# Altium schematic sheet ESC.SchDoc: Top Level
size A3; CompanyName: NOT USED; DocumentNumber: 2; SheetNumber: 2; SheetTotal: 2; PageSetup: Record=PageOptions|CenterHorizontal=True|CenterVertical=True|PrintScale=1.00|XCorrection=1.00|YCorrection=1.00|PrintKind=0|BorderSize=5000000|LeftOffset=0|BottomOffset=0|Orientation=2|PaperLength=1000|PaperWidth=1000|Scale=100|PaperSource=7|PrintQuality=-4|MediaType=1|DitherType=10|PaperKind=A3|PrintScaleMode=0
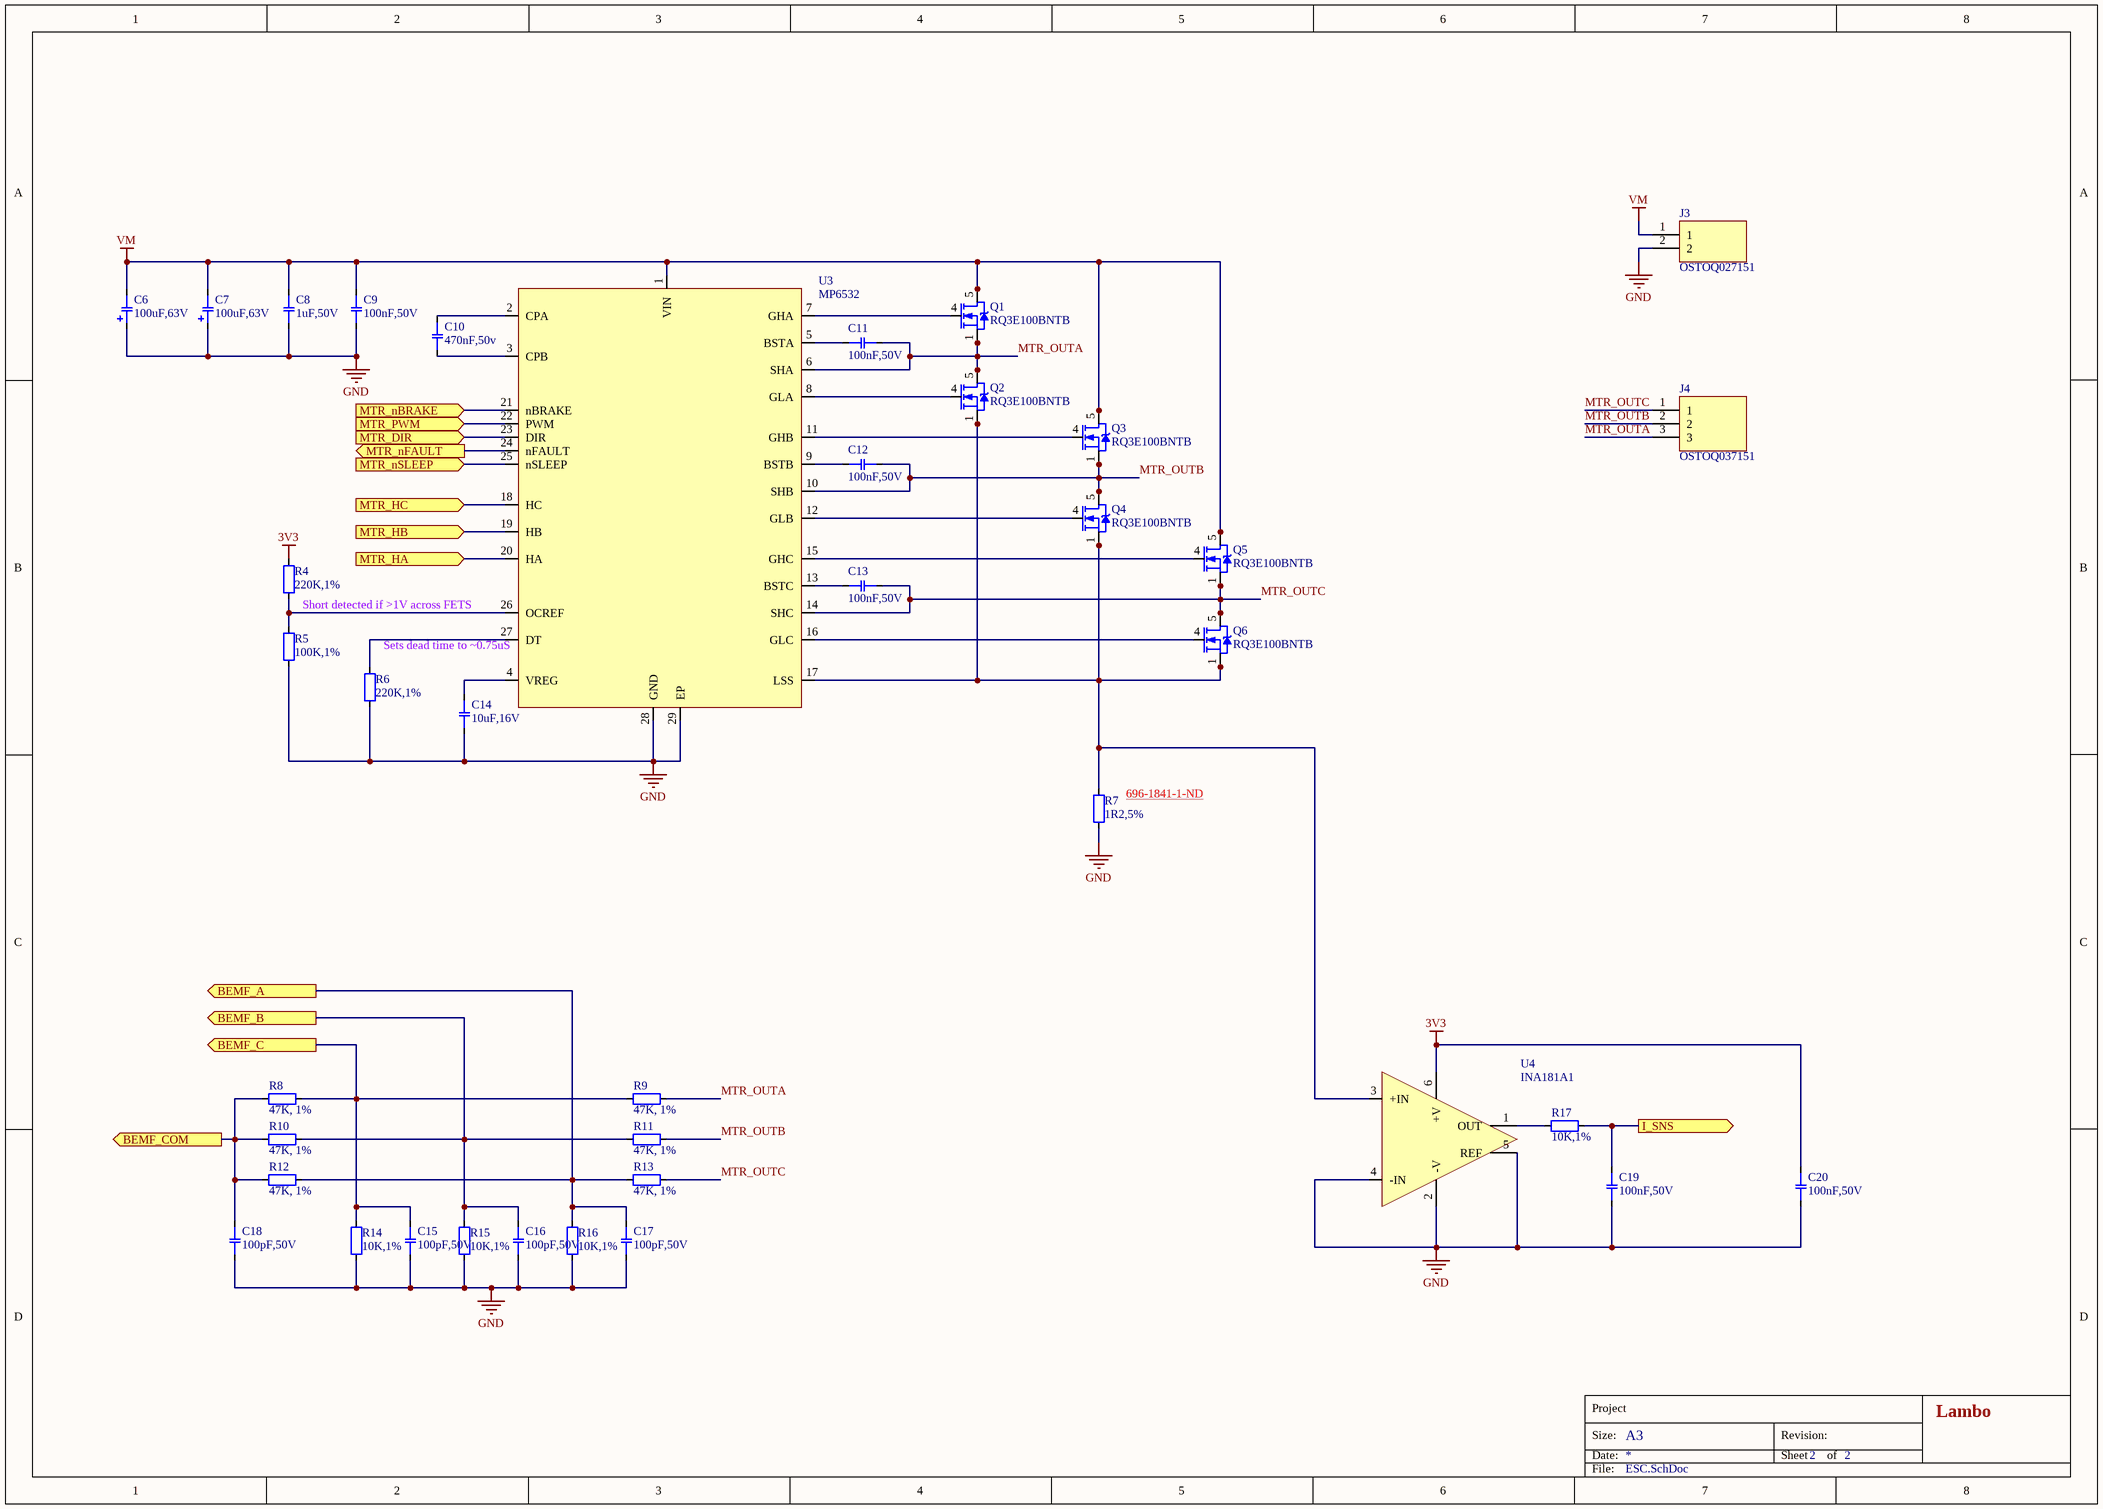
[diagram p0: ESC.SchDoc]

## Parts
C6  100uF,63V  [CAPAE1030X1020N]
C7  100uF,63V  [CAPAE1030X1020N]
C8  1uF,50V  [CAPC1608X09N_0603]
C9  100nF,50V  [CAPC1608X09N_0603]
C10  470nF,50v  [CAPC1608X09N_0603]
C11  100nF,50V  [CAPC1608X09N_0603]
C12  100nF,50V  [CAPC1608X09N_0603]
C13  100nF,50V  [CAPC1608X09N_0603]
C14  10uF,16V  [CAPC2012X12N_0805]
C15  100pF,50V  [CAPC1608X09N_0603]
C16  100pF,50V  [CAPC1608X09N_0603]
C17  100pF,50V  [CAPC1608X09N_0603]
C18  100pF,50V  [CAPC1608X09N_0603]
C19  100nF,50V  [CAPC1608X09N_0603]
C20  100nF,50V  [CAPC1608X09N_0603]
J3  OSTOQ027151  [ONSHORE_OSTOQ027151]
J4  OSTOQ037151  [ONSHORE_OSTOQ037151]
Q1  RQ3E100BNTB  [ROHM-HSMT8]
Q2  RQ3E100BNTB  [ROHM-HSMT8]
Q3  RQ3E100BNTB  [ROHM-HSMT8]
Q4  RQ3E100BNTB  [ROHM-HSMT8]
Q5  RQ3E100BNTB  [ROHM-HSMT8]
Q6  RQ3E100BNTB  [ROHM-HSMT8]
R4  220K,1%  [RESC1608X06N_0603]
R5  100K,1%  [RESC1608X06N_0603]
R6  220K,1%  [RESC1608X06N_0603]
R7  1R2,5%  [RESC6432X07N_2512]
R8  47K, 1%  [RESC1608X06N_0603]
R9  47K, 1%  [RESC1608X06N_0603]
R10  47K, 1%  [RESC1608X06N_0603]
R11  47K, 1%  [RESC1608X06N_0603]
R12  47K, 1%  [RESC1608X06N_0603]
R13  47K, 1%  [RESC1608X06N_0603]
R14  10K,1%  [RESC1608X06N_0603]
R15  10K,1%  [RESC1608X06N_0603]
R16  10K,1%  [RESC1608X06N_0603]
R17  10K,1%  [RESC1608X06N_0603]
U3  MP6532  [QFN40P400X400X100-28N_28QFN]
U4  INA181A1  [SOT95P280X145-6N_SOT23-6]

## Ports
BEMF_A (out), BEMF_B (out), BEMF_C (out), BEMF_COM (out), I_SNS (out), MTR_DIR (in), MTR_HA (in), MTR_HB (in), MTR_HC (in), MTR_nBRAKE (in), MTR_nFAULT (out), MTR_nSLEEP (in), MTR_PWM (in)

## Nets
3V3: C20.1 R4.2 U4.6(+V)
GND: C6.1(+) C7.1(+) C8.1 C9.2 C14.1 C15.1 C16.1 C17.1 C18.1 C19.2 C20.2 J3.2 R5.1 R6.1 R7.1 R14.2 R15.2 R16.2 U3.28(GND) U3.29(EP) U4.2(-V) U4.4(-IN) U4.5(REF)
VM: C6.2(-) C7.2(-) C8.2 C9.1 J3.1 Q1.5(D) Q1.6(D) Q1.7(D) Q1.8(D) Q3.5(D) Q3.6(D) Q3.7(D) Q3.8(D) Q5.5(D) Q5.6(D) Q5.7(D) Q5.8(D) U3.1(VIN)
BEMF_A: C17.2 R12.2 R13.1 R16.1 ; port BEMF_A
BEMF_B: C16.2 R10.2 R11.1 R15.1 ; port BEMF_B
BEMF_C: C15.2 R8.2 R9.1 R14.1 ; port BEMF_C
BEMF_COM: C18.2 R8.1 R10.1 R12.1 ; port BEMF_COM
I_SNS: C19.1 R17.1 ; port I_SNS
MTR_DIR: U3.23(DIR) ; port MTR_DIR
MTR_HA: U3.20(HA) ; port MTR_HA
MTR_HB: U3.19(HB) ; port MTR_HB
MTR_HC: U3.18(HC) ; port MTR_HC
MTR_nBRAKE: U3.21(nBRAKE) ; port MTR_nBRAKE
MTR_nFAULT: U3.24(nFAULT) ; port MTR_nFAULT
MTR_nSLEEP: U3.25(nSLEEP) ; port MTR_nSLEEP
MTR_OUTA: C11.1 J4.3 Q1.1(S) Q1.2(S) Q1.3(S) Q2.5(D) Q2.6(D) Q2.7(D) Q2.8(D) R9.2 U3.6(SHA)
MTR_OUTB: C12.1 J4.2 Q3.1(S) Q3.2(S) Q3.3(S) Q4.5(D) Q4.6(D) Q4.7(D) Q4.8(D) R11.2 U3.10(SHB)
MTR_OUTC: C13.1 J4.1 Q5.1(S) Q5.2(S) Q5.3(S) Q6.5(D) Q6.6(D) Q6.7(D) Q6.8(D) R13.2 U3.14(SHC)
MTR_PWM: U3.22(PWM) ; port MTR_PWM
NetC10_1: C10.1 U3.3(CPB)
NetC10_2: C10.2 U3.2(CPA)
NetC11_2: C11.2 U3.5(BSTA)
NetC12_2: C12.2 U3.9(BSTB)
NetC13_2: C13.2 U3.13(BSTC)
NetC14_2: C14.2 U3.4(VREG)
NetQ1_4: Q1.4(G) U3.7(GHA)
NetQ2_1: Q2.1(S) Q2.2(S) Q2.3(S) Q4.1(S) Q4.2(S) Q4.3(S) Q6.1(S) Q6.2(S) Q6.3(S) R7.2 U3.17(LSS) U4.3(+IN)
NetQ2_4: Q2.4(G) U3.8(GLA)
NetQ3_4: Q3.4(G) U3.11(GHB)
NetQ4_4: Q4.4(G) U3.12(GLB)
NetQ5_4: Q5.4(G) U3.15(GHC)
NetQ6_4: Q6.4(G) U3.16(GLC)
NetR4_1: R4.1 R5.2 U3.26(OCREF)
NetR6_2: R6.2 U3.27(DT)
NetR17_2: R17.2 U4.1(OUT)

## Notes on the sheet
- Short detected if >1V across FETS
- (near U3) Sets dead time to ~0.75uS
- (near R7) 696-1841-1-ND <https://www.digikey.co.nz/product-detail/en/riedon/CSRL3-0R05F8/696-1841-1-ND/9666105>
- Project
- Size:
- Date:
- A3
- Revision:
- Sheet
- of
- Lambo
- File:

## Library data of the parts
C6 C7 = CEG-1070T-H: CAP ALUM 100UF 63V 20% SMD; Manufacturer: Panasonic Electronic Components; Manufacturer Part Number: EEE-FK1J101P; Dielectric: Aluminium; Type: Electrolytic; Display_Name: 100uF,63V; Capacitance: 100uF; Tolerance: 20%; Voltage: 63V; BWA PN: CEG-1070T-H; Schematic Symbol: CAP-POL_1; Supplier 1: Digi-Key; Supplier Part Number 1: PCE3819CT-ND
C8 = CCH-106DH-G-A: AUTOMOTIVE CAP CER 1UF 50V 10% X5R 0603; Manufacturer: TDK Corporation; Manufacturer Part Number: CGA3E3X5R1H105K080AB; Type: Ceramic; Display_Name: 1uF,50V; Capacitance: 1uF; Dielectric: X5R; Tolerance: 10%; Voltage: 50V; BWA PN: CCH-106DH-G-A; Schematic Symbol: CAP-NP_1; Supplier 1: Digi-Key; Supplier Part Number 1: 445-7878-1-ND
C9 C11-C13 C19 C20 = CCH-104CH-G: CAP CER 0.1UF 50V 10% X7R 0603; Manufacturer: Kemet; Manufacturer Part Number: C0603C104K5RACTU; Type: Ceramic; Display_Name: 100nF,50V; Capacitance: 100nF; Dielectric: X7R; Tolerance: 10%; Voltage: 50V; BWA PN: CCH-104CH-G; Schematic Symbol: CAP-NP_1; Supplier 1: Digi-Key; Supplier Part Number 1: 399-5089-1-ND
C10 = CCH-474DH-G-A: AUTOMOTIVE CAP CER 470nF 50V 10% X5R 0603; Manufacturer: Taiyo Yuden; Manufacturer Part Number: UMK107BJ474KAHT; Type: Ceramic; Display_Name: 470nF,50v; Capacitance: 470nF; Dielectric: X5R; Tolerance: 10%; Voltage: 50V; BWA PN: CCH-474DH-G-A; Schematic Symbol: CAP-NP_1; Supplier 1: Digi-Key; Supplier Part Number 1: 587-3506-1-ND
C14 = CCI-106CE-G: CAP CER 10µF ±10% 16V X7R 0805; Manufacturer: Samsung Electro-Mechanics America, Inc.; Manufacturer Part Number: CL21B106KOQNNNG; Type: Ceramic; Display_Name: 10uF,16V; Capacitance: 10uF; Dielectric: X7R; Tolerance: 10%; Voltage: 16V; BWA PN: CCI-106CE-G; Schematic Symbol: CAP-NP_1; Supplier 1: Digi-Key; Supplier Part Number 1: 1276-6472-1-ND
C15-C18 = CCH-101AH-G: CAP CER 100PF 50V 10% NP0 0603; Manufacturer: AVX; Manufacturer Part Number: 06035A101KAT2A; Dielectric: C0G,NP0; Type: Ceramic; Display_Name: 100pF,50V; Capacitance: 100pF; Tolerance: 10%; Voltage: 50V; BWA PN: CCH-101AH-G; Schematic Symbol: CAP-NP_1; Supplier 1: Digi-Key; Supplier Part Number 1: 478-3717-1-ND
J3 = CON-10606-A: TERM BLOCK HDR 2POS R/A 5MM; Manufacturer: On Shore Technology Inc; Contacts: 2; Pitch: 5.0; Rows: 1; Display_Name: OSTOQ027151; Series: OQ; Type: HEADER; BWA PN: CON-10606-A; Schematic Symbol: ONSHORE_OSTOQ027151; Manufacturer Part Number: OSTOQ027151; Supplier 1: Digi-Key; Supplier Part Number 1: ED2791-ND
J4 = CON-10607-A: TERM BLOCK HDR 3POS R/A 5MM; Manufacturer: On Shore Technology Inc; Contacts: 3; Pitch: 5.0; Rows: 1; Display_Name: OSTOQ037151; Series: OQ; Type: HEADER; BWA PN: CON-10607-A; Schematic Symbol: ONSHORE_OSTOQ037151; Manufacturer Part Number: OSTOQ037151; Supplier 1: Digi-Key; Supplier Part Number 1: ED2792-ND
Q1-Q6 = TRN-10123-A: MOSFET N-CH 30V 10A 8HSMT; Manufacturer: Rohm Semiconductor; Type: N; rds(on): 10.4mOhm @ 10A, 10V; Vgs(max): ±20V; Vth(max): 2.5V @ 1mA; Display_Name: RQ3E100BNTB; BWA PN: TRN-10123-A; Id(max): 10A; Vds(max): 30V; Schematic Symbol: MOSFET-N-QFN8; Manufacturer Part Number: RQ3E100BNTB; Supplier 1: Digi-Key; Supplier Part Number 1: RQ3E100BNTBCT-ND
R4 R6 = RSH-220K0-D: RES 220K OHM 1/10W 1% 0603 SMD; Manufacturer: Yageo; Manufacturer Part Number: RC0603FR-07220KL; Power: 0.1W; Display_Name: 220K,1%; Resistance: 220K; Tolerance: 1%; Type: Chip; BWA PN: RSH-220K0-D; Schematic Symbol: RESISTOR_1; Supplier 1: Digi-Key; Supplier Part Number 1: 311-220KHRCT-ND
R5 = RSH-100K0-D: RES 100K OHM 1/10W 1% 0603 SMD; Manufacturer: Yageo; Manufacturer Part Number: RC0603FR-07100KL; Power: 0.1W; Display_Name: 100K,1%; Resistance: 100K; Tolerance: 1%; Type: Chip; BWA PN: RSH-100K0-D; Schematic Symbol: RESISTOR_1; Supplier 1: Digi-Key; Supplier Part Number 1: 311-100KHRCT-ND
R7 = RSV-1R200-F: RES SMD 1.2 OHM 5% 3W 2512; Manufacturer: TE Connectivity Passive Product; Manufacturer Part Number: 35221R2JT; Display_Name: 1R2,5%; Power: 3W; Resistance: 1R2; Tolerance: 5%; Type: Chip; BWA PN: RSV-1R200-F; Schematic Symbol: RESISTOR_1; Supplier 1: Digi-Key; Supplier Part Number 1: A121178CT-ND
R8-R13 = RSH-47K00-D-A: AUTOMOTIVE RES 47.0K OHM 1/10W 1% 0603 SMD; Manufacturer: Vishay Dale; Manufacturer Part Number: CRCW060347K0FKEA; Power: 0.1W; Display_Name: 47K, 1%; Resistance: 47k; Tolerance: 1%; Type: Chip; BWA PN: RSH-47K00-D-A; Schematic Symbol: RESISTOR_1; Supplier 1: Digi-Key; Supplier Part Number 1: 541-47.0KHCT-ND
R14-R17 = RSH-10K00-D: RES 10.0K OHM 1/10W 1% 0603 SMD; Manufacturer: Yageo; Manufacturer Part Number: RC0603FR-0710KL; Power: 0.1W; Display_Name: 10K,1%; Resistance: 10K; Tolerance: 1%; Type: Chip; BWA PN: RSH-10K00-D; Schematic Symbol: RESISTOR_1; Supplier 1: Digi-Key; Supplier Part Number 1: 311-10.0KHRCT-ND
U3 = ICT-10928-A: IC MOTOR DRIVER 5V-60V 28QFN; Manufacturer: Monolithic Power Systems Inc.; Manufacturer Part Number: MP6532-GR-Z; Temp Range: -40°C ~ 125°C; Display_Name: MP6532; BWA PN: ICT-10928-A; Schematic Symbol: MP6532; Supplier 1: Digi-Key; Supplier Part Number 1: 589-MP6532-GR-ZCT-ND
U4 = ICT-10756-A: IC AMP CUR SENSE 350KHZ SOT23-6; Manufacturer: Texas Instruments; Manufacturer Part Number: INA181A1IDBVT; Temp Range: -40°C ~ 125°C; Display_Name: INA181A1; BWA PN: ICT-10756-A; Schematic Symbol: INA181AX; Supplier 1: Digi-Key; Supplier Part Number 1: 296-46634-1-ND